# Altium schematic sheet Micro_M3.SchDoc
size B; Author: Santiago A. Laborde
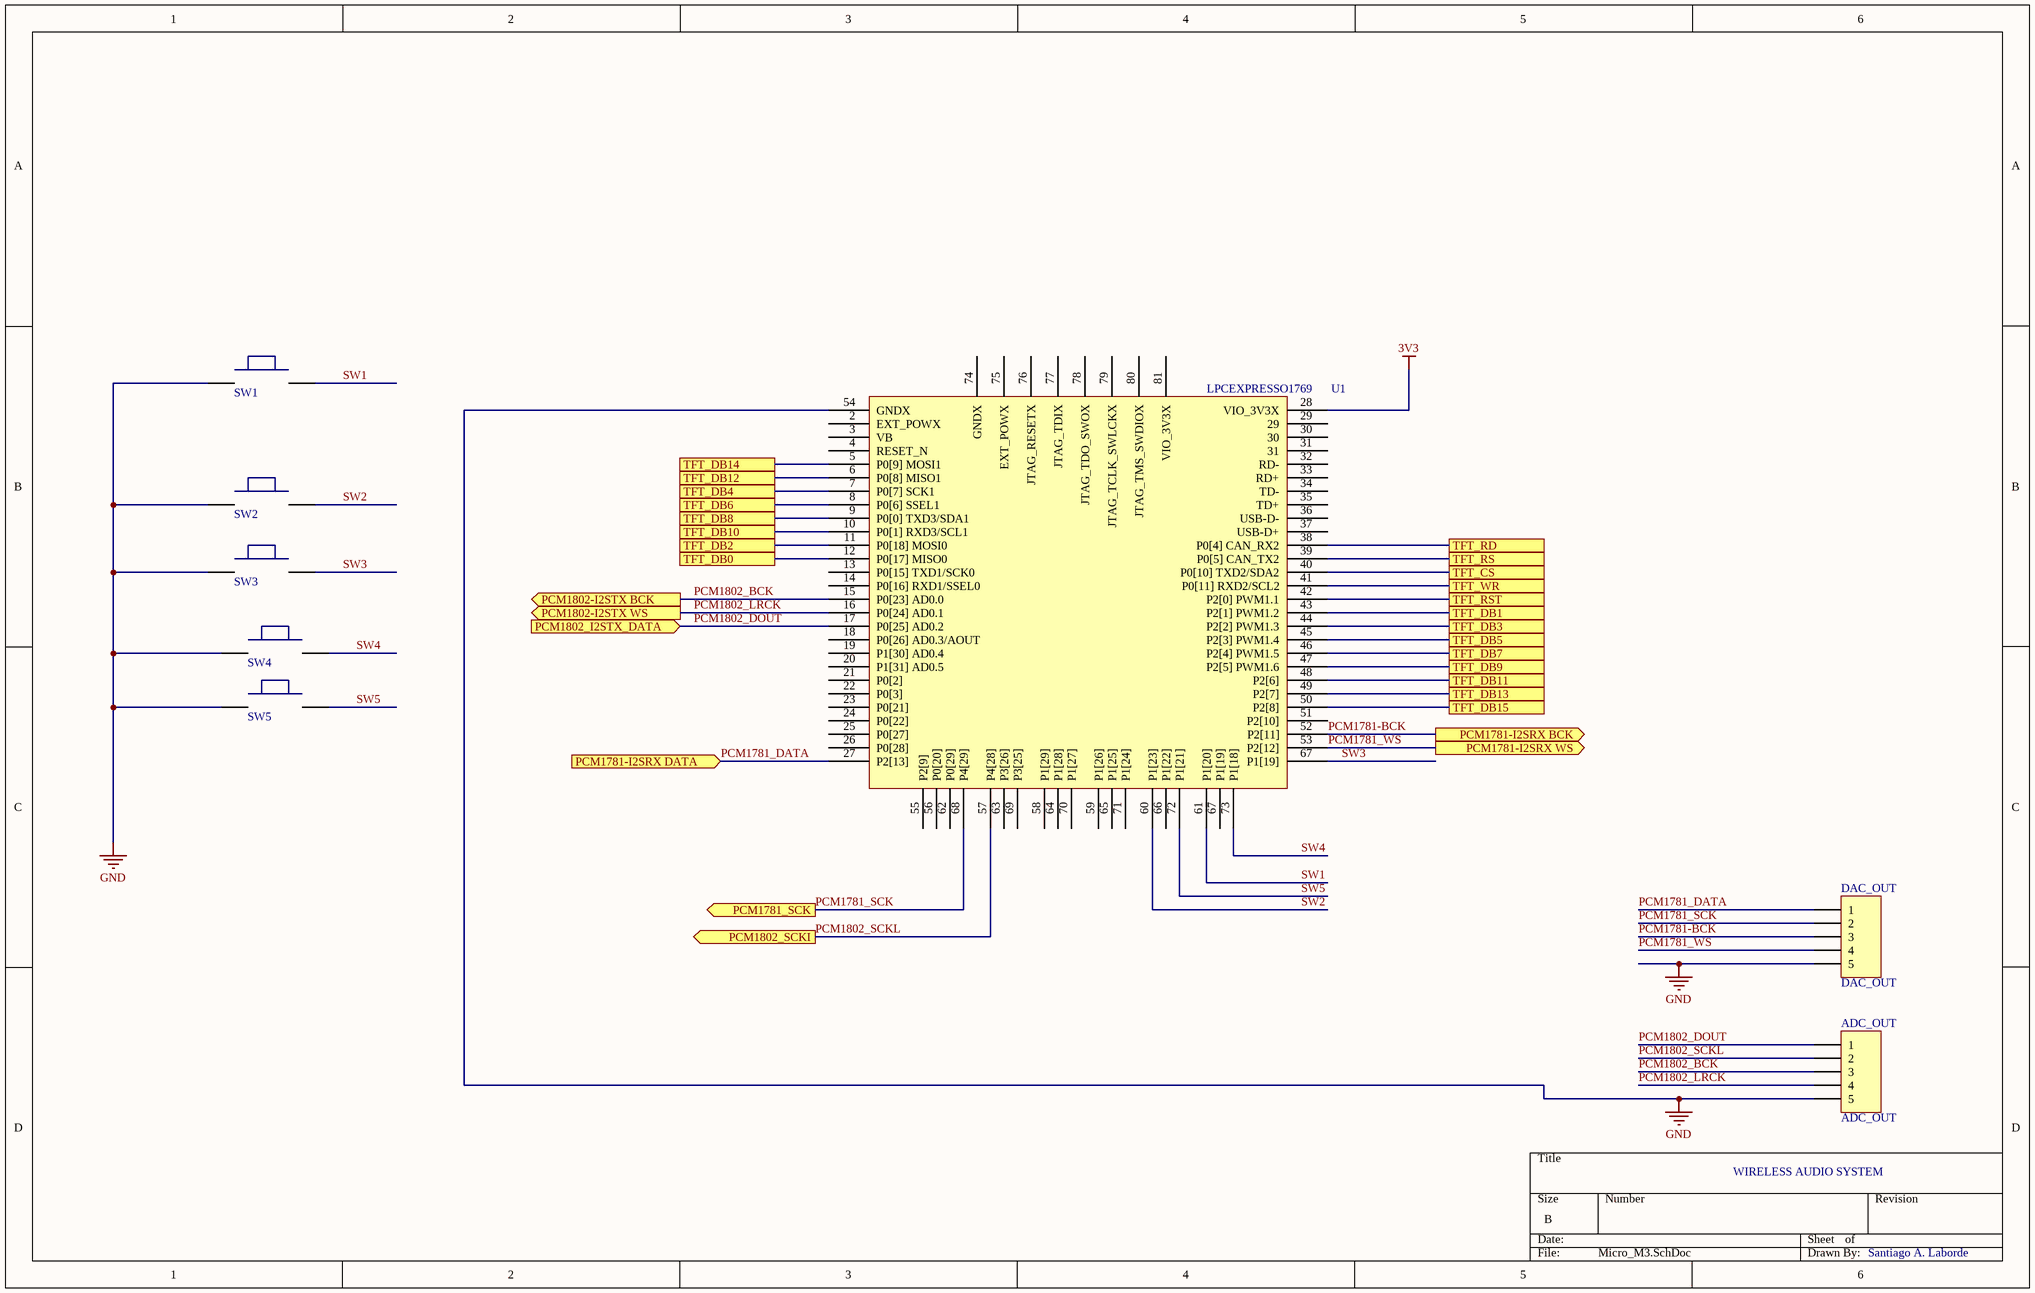
[diagram p0: Micro_M3.SchDoc]

## Parts
ADC_OUT  ADC_OUT  [HDR1X5]
DAC_OUT  DAC_OUT  [HDR1X5]
SW1  PULSADOR  [Pulsador]  (value not drawn)
SW2  PULSADOR  [Pulsador]  (value not drawn)
SW3  PULSADOR  [Pulsador]  (value not drawn)
SW4  PULSADOR  [Pulsador]  (value not drawn)
SW5  PULSADOR  [SW_SMD(2)]  (value not drawn)
U1  LPCEXPRESSO1769  [LPCEXPRESSO1769]

## Ports
PCM1781-I2SRX BCK (out), PCM1781-I2SRX DATA (in), PCM1781-I2SRX WS (out), PCM1781_SCK (out), PCM1802-I2STX BCK (out), PCM1802-I2STX WS (out), PCM1802_I2STX_DATA (in), PCM1802_SCKI (out), TFT_CS, TFT_DB0, TFT_DB1, TFT_DB2, TFT_DB3, TFT_DB4, TFT_DB5, TFT_DB6, TFT_DB7, TFT_DB8, TFT_DB9, TFT_DB10, TFT_DB11, TFT_DB12, TFT_DB13, TFT_DB14, TFT_DB15, TFT_RD, TFT_RS, TFT_RST, TFT_WR

## Nets
3V3: U1.28(VIO_3V3X)
GND: ADC_OUT.5 DAC_OUT.5 SW1.1 SW2.1 SW3.1 SW4.1 SW5.1 U1.54(GNDX)
PCM1781-BCK: DAC_OUT.3 U1.52(P2[11]) ; port PCM1781-I2SRX BCK
PCM1781_DATA: DAC_OUT.1 U1.27(P2[13]) ; port PCM1781-I2SRX DATA
PCM1781_SCK: DAC_OUT.2 U1.68(P4[29]) ; port PCM1781_SCK
PCM1781_WS: DAC_OUT.4 U1.53(P2[12]) ; port PCM1781-I2SRX WS
PCM1802_BCK: ADC_OUT.3 U1.15(P0[23]_AD0.0) ; port PCM1802-I2STX BCK
PCM1802_DOUT: ADC_OUT.1 U1.17(P0[25]_AD0.2) ; port PCM1802_I2STX_DATA
PCM1802_LRCK: ADC_OUT.4 U1.16(P0[24]_AD0.1) ; port PCM1802-I2STX WS
PCM1802_SCKL: ADC_OUT.2 U1.57(P4[28]) ; port PCM1802_SCKI
SW1: SW1.2 U1.61(P1[20])
SW2: SW2.2 U1.60(P1[23])
SW3: SW3.2 U1.67(P1[19])
SW4: SW4.2 U1.73(P1[18])
SW5: SW5.2 U1.72(P1[21])
TFT_CS: U1.40(P0[10]_TXD2/SDA2) ; port TFT_CS
TFT_DB0: U1.12(P0[17]_MISO0) ; port TFT_DB0
TFT_DB1: U1.43(P2[1]_PWM1.2) ; port TFT_DB1
TFT_DB2: U1.11(P0[18]_MOSI0) ; port TFT_DB2
TFT_DB3: U1.44(P2[2]_PWM1.3) ; port TFT_DB3
TFT_DB4: U1.7(P0[7]_SCK1) ; port TFT_DB4
TFT_DB5: U1.45(P2[3]_PWM1.4) ; port TFT_DB5
TFT_DB6: U1.8(P0[6]_SSEL1) ; port TFT_DB6
TFT_DB7: U1.46(P2[4]_PWM1.5) ; port TFT_DB7
TFT_DB8: U1.9(P0[0]_TXD3/SDA1) ; port TFT_DB8
TFT_DB9: U1.47(P2[5]_PWM1.6) ; port TFT_DB9
TFT_DB10: U1.10(P0[1]_RXD3/SCL1) ; port TFT_DB10
TFT_DB11: U1.48(P2[6]) ; port TFT_DB11
TFT_DB12: U1.6(P0[8]_MISO1) ; port TFT_DB12
TFT_DB13: U1.49(P2[7]) ; port TFT_DB13
TFT_DB14: U1.5(P0[9]_MOSI1) ; port TFT_DB14
TFT_DB15: U1.50(P2[8]) ; port TFT_DB15
TFT_RD: U1.38(P0[4]_CAN_RX2) ; port TFT_RD
TFT_RS: U1.39(P0[5]_CAN_TX2) ; port TFT_RS
TFT_RST: U1.42(P2[0]_PWM1.1) ; port TFT_RST
TFT_WR: U1.41(P0[11]_RXD2/SCL2) ; port TFT_WR

Not connected (* = marked no-connect by the designer): U1 2(EXT_POWX) 3(VB) 4(RESET_N) 13(P0[15]_TXD1/SCK0) 14(P0[16]_RXD1/SSEL0) 18(P0[26]_AD0.3/AOUT) 19(P1[30]_AD0.4) 20(P1[31]_AD0.5) 21(P0[2]) 22(P0[3]) 23(P0[21]) 24(P0[22]) 25(P0[27]) 26(P0[28]) 29 30 31 32(RD-) 33(RD+) 34(TD-) 35(TD+) 36(USB-D-) 37(USB-D+) 51(P2[10]) 55(P2[9]) 56(P0[20]) 58(P1[29]) 59(P1[26]) 62(P0[29]) 63(P3[26]) 64(P1[28]) 65(P1[25]) 66(P1[22]) 69(P3[25]) 70(P1[27]) 71(P1[24]) 74(GNDX) 75(EXT_POWX) 76(JTAG_RESETX) 77(JTAG_TDIX) 78(JTAG_TDO_SWOX) 79(JTAG_TCLK_SWLCKX) 80(JTAG_TMS_SWDIOX) 81(VIO_3V3X)

## Notes on the sheet
- WIRELESS AUDIO SYSTEM

## Library data of the parts
ADC_OUT DAC_OUT = Header 5: Header, 5-Pin; LatestRevisionDate: 17-Jul-2002; LatestRevisionNote: Re-released for DXP Platform.; Publisher: Altium Limited